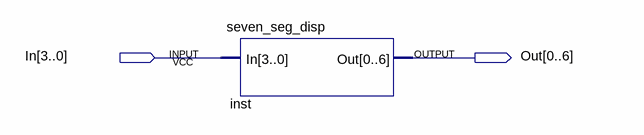
[diagram p0: schematic sheet]
// Quartus schematic seven_seg_disp_test.bdf as structural Verilog: 1 symbols, 2 pins
module seven_seg_disp_test (
  input  [3:0] In,
  output [0:6] Out
);

  seven_seg_disp inst (.In(In), .Out(Out));
endmodule
